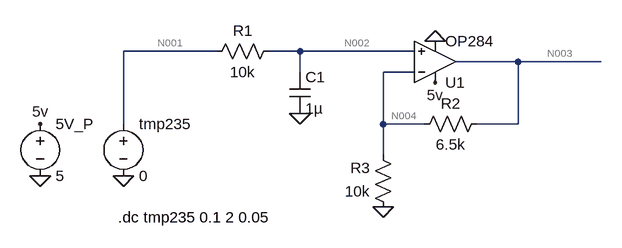
[diagram p0: schematic OBATS_Front_End_Signal_Chain.asc]
OBATS_Front_End_Signal_Chain.asc, the LTspice schematic file:
Version 4
SHEET 1 880 680
WIRE -128 112 -272 112
WIRE 0 112 -48 112
WIRE 176 112 0 112
WIRE 336 128 240 128
WIRE 464 128 336 128
WIRE 0 144 0 112
WIRE 176 144 128 144
WIRE -272 224 -272 112
WIRE 128 224 128 144
WIRE 192 224 128 224
WIRE 336 224 336 128
WIRE 336 224 272 224
WIRE 128 272 128 224
FLAG -272 304 0
FLAG -400 304 0
FLAG 128 352 0
FLAG 0 208 0
FLAG 208 96 0
FLAG -400 224 5v
FLAG 208 160 5v
SYMBOL Opamps\\OP284 208 192 M180
SYMATTR InstName U1
SYMBOL voltage -272 208 R0
SYMATTR InstName tmp235
SYMATTR Value 0
SYMBOL voltage -400 208 R0
SYMATTR InstName 5V_P
SYMATTR Value 5
SYMBOL res -32 96 R90
WINDOW 0 0 56 VBottom 2
WINDOW 3 32 56 VTop 2
SYMATTR InstName R1
SYMATTR Value 10k
SYMBOL cap -16 144 R0
SYMATTR InstName C1
SYMATTR Value 1µ
SYMBOL res 288 208 R90
WINDOW 0 0 56 VBottom 2
WINDOW 3 32 56 VTop 2
SYMATTR InstName R2
SYMATTR Value 6.5k
SYMBOL res 144 368 R180
WINDOW 0 36 76 Left 2
WINDOW 3 36 40 Left 2
SYMATTR InstName R3
SYMATTR Value 10k
TEXT -280 368 Left 2 !.dc tmp235 0.1 2 0.05

The netlist it stands for:
* OBATS_Front_End_Signal_Chain.asc
XU1 N002 N004 5v 0 N003 OP284  ; pins In+ In- V+ V- OUT
V§tmp235 N001 0 0
V§5V_P 5v 0 5
R1 N002 N001 10k
C1 N002 0 1µ
R2 N003 N004 6.5k
R3 0 N004 10k
.dc tmp235 0.1 2 0.05
.lib ADI1.lib
.backanno
.end

* Results of the author's LTspice run, read from the files saved beside the schematic
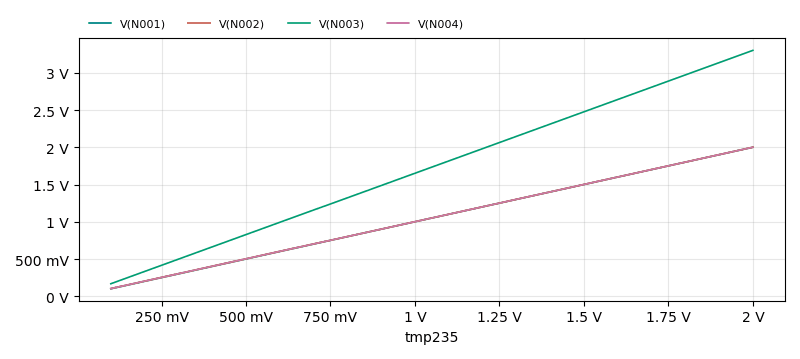
[diagram p1: DC transfer characteristic of OBATS_Front_End_Signal_Chain.asc, plotted from the saved traces]
* DC transfer characteristic, 1 run:
*   V(N001): 100 mV at tmp235=100 mV, 2 V at tmp235=2 V, min 100 mV, max 2 V
*   V(N002): 102.9 mV at tmp235=100 mV, 2.001 V at tmp235=2 V, min 102.9 mV, max 2.001 V
*   V(N003): 168 mV at tmp235=100 mV, 3.301 V at tmp235=2 V, min 168 mV, max 3.301 V
*   V(N004): 102.9 mV at tmp235=100 mV, 2.001 V at tmp235=2 V, min 102.9 mV, max 2.001 V